# Altium schematic sheet STM32F750N8H6.SchDoc
size C
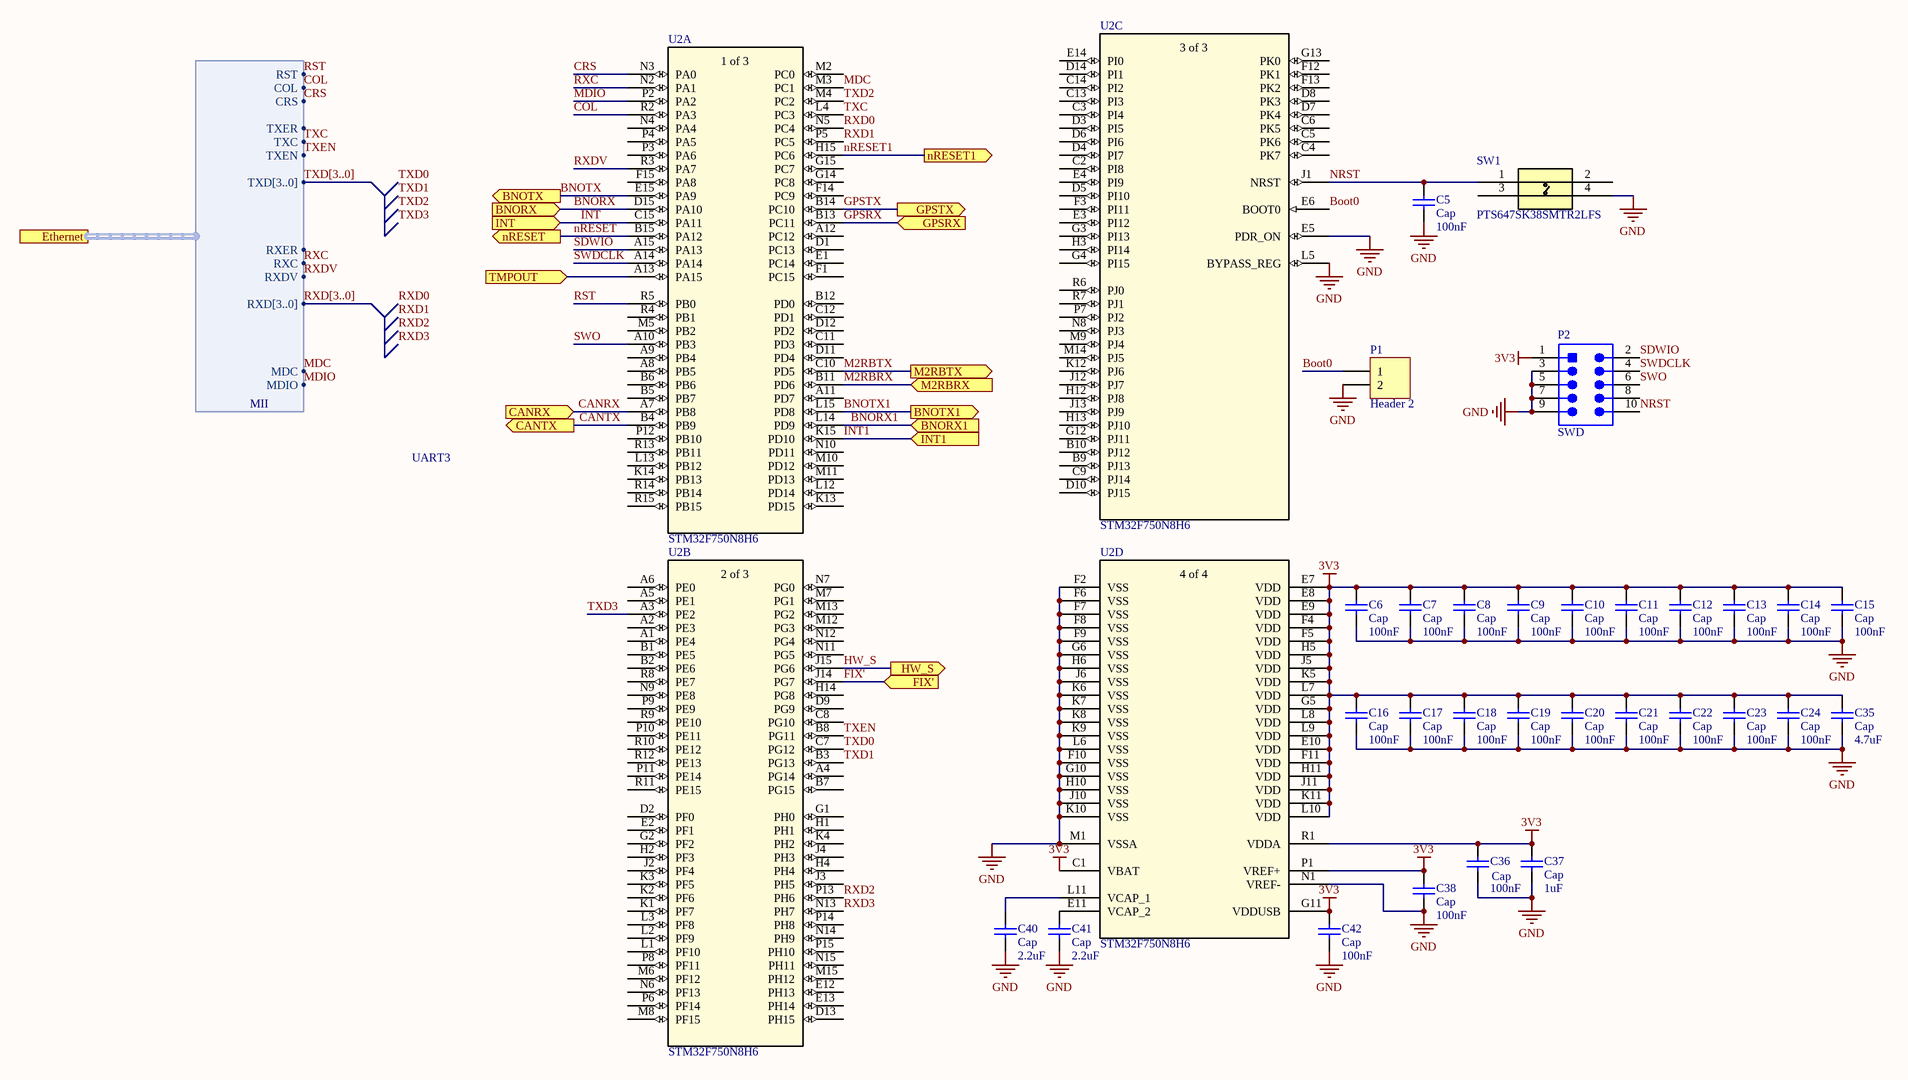
[diagram p0: STM32F750N8H6.SchDoc]

## Parts
C5  Cap  value 100nF  [1608[0603]]
C6  Cap  value 100nF  [0402-A]
C7  Cap  value 100nF  [0402-A]
C8  Cap  value 100nF  [0402-A]
C9  Cap  value 100nF  [0402-A]
C10  Cap  value 100nF  [0402-A]
C11  Cap  value 100nF  [0402-A]
C12  Cap  value 100nF  [0402-A]
C13  Cap  value 100nF  [0402-A]
C14  Cap  value 100nF  [0402-A]
C15  Cap  value 100nF  [0402-A]
C16  Cap  value 100nF  [0402-A]
C17  Cap  value 100nF  [0402-A]
C18  Cap  value 100nF  [0402-A]
C19  Cap  value 100nF  [0402-A]
C20  Cap  value 100nF  [0402-A]
C21  Cap  value 100nF  [0402-A]
C22  Cap  value 100nF  [0402-A]
C23  Cap  value 100nF  [0402-A]
C24  Cap  value 100nF  [0402-A]
C35  Cap  value 4.7uF  [1608[0603]]
C36  Cap  value 100nF  [0402-A]
C37  Cap  value 1uF  [0402-A]
C38  Cap  value 100nF  [0402-A]
C40  Cap  value 2.2uF  [0402-A]
C41  Cap  value 2.2uF  [0402-A]
C42  Cap  value 100nF  [0402-A]
P1  Header 2  [HDR1X2]
P2  SWD  [SMTC-FTSH-105-01-L-DV-K_V]
SW1  PTS647SK38SMTR2LFS  [PTS647SK38SMTR2LFS_CNK]
U2  STM32F750N8H6  [TFBGA216_13X13_STM]  (parts A,B,C,D of 4)

## Ports
BNORX1 (in), BNORX (in), BNOTX1 (out), BNOTX (out), CANRX (in), CANTX (out), Ethernet (harness MII), FIX' (in), GPSRX (in), GPSTX (out), HW_S (out), INT1 (in), INT (in), M2RBRX (in), M2RBTX (out), nRESET1 (out), nRESET (out), TMPOUT (in)

## Harnesses
MII: MDIO, MDC, RXD[3..0], TXD[3..0], RXDV, RXC, RXER, TXEN, TXC, TXER, CRS, COL, RST

## Nets
3V3: C6.2 C7.2 C8.2 C9.2 C10.2 C11.2 C12.2 C13.2 C14.2 C15.2 C16.2 C17.2 C18.2 C19.2 C20.2 C21.2 C22.2 C23.2 C24.2 C35.2 C36.2 C37.2 C38.2 C42.2 P2.1 U2.C1(VBAT) U2.E7(VDD) U2.E8(VDD) U2.E9(VDD) U2.E10(VDD) U2.F4(VDD) U2.F5(VDD) U2.F11(VDD) U2.G5(VDD) U2.G11(VDDUSB) U2.H5(VDD) U2.H11(VDD) U2.J5(VDD) U2.J11(VDD) U2.K5(VDD) U2.K11(VDD) U2.L7(VDD) U2.L8(VDD) U2.L9(VDD) U2.L10(VDD) U2.P1(VREF+) U2.R1(VDDA)
GND: C5.1 C6.1 C7.1 C8.1 C9.1 C10.1 C11.1 C12.1 C13.1 C14.1 C15.1 C16.1 C17.1 C18.1 C19.1 C20.1 C21.1 C22.1 C23.1 C24.1 C35.1 C36.1 C37.1 C38.1 C40.1 C41.1 C42.1 P1.2 P2.3 P2.5 P2.7 P2.9 SW1.4 U2.E5(PDR_ON) U2.F2(VSS) U2.F6(VSS) U2.F7(VSS) U2.F8(VSS) U2.F9(VSS) U2.F10(VSS) U2.G6(VSS) U2.G10(VSS) U2.H6(VSS) U2.H10(VSS) U2.J6(VSS) U2.J10(VSS) U2.K6(VSS) U2.K7(VSS) U2.K8(VSS) U2.K9(VSS) U2.K10(VSS) U2.L5(BYPASS_REG) U2.L6(VSS) U2.M1(VSSA) U2.N1(VREF-)
BNORX: U2.D15(PA10) ; port BNORX
BNORX1: U2.L14(PD9) ; port BNORX1
BNOTX: U2.E15(PA9) ; port BNOTX
BNOTX1: U2.L15(PD8) ; port BNOTX1
Boot0: P1.1 U2.E6(BOOT0)
CANRX: U2.A7(PB8) ; port CANRX
CANTX: U2.B4(PB9) ; port CANTX
COL: U2.R2(PA3) ; port Ethernet.COL
CRS: U2.N3(PA0) ; port Ethernet.CRS
FIX': U2.J14(PG7) ; port FIX'
GPSRX: U2.B13(PC11) ; port GPSRX
GPSTX: U2.B14(PC10) ; port GPSTX
HW_S: U2.J15(PG6) ; port HW_S
INT: U2.C15(PA11) ; port INT
INT1: U2.K15(PD10) ; port INT1
M2RBRX: U2.B11(PD6) ; port M2RBRX
M2RBTX: U2.C10(PD5) ; port M2RBTX
MDC: U2.M3(PC1) ; port Ethernet.MDC
MDIO: U2.P2(PA2) ; port Ethernet.MDIO
nRESET: U2.B15(PA12) ; port nRESET
nRESET1: U2.H15(PC6) ; port nRESET1
NRST: C5.2 P2.10 SW1.1 U2.J1(NRST)
RST: U2.R5(PB0) ; port Ethernet.RST
RXC: U2.N2(PA1) ; port Ethernet.RXC
RXD0: U2.N5(PC4)
RXD1: U2.P5(PC5)
RXD2: U2.P13(PH6)
RXD3: U2.N13(PH7)
RXDV: U2.R3(PA7) ; port Ethernet.RXDV
SDWIO: P2.2 U2.A15(PA13)
SWDCLK: P2.4 U2.A14(PA14)
SWO: P2.6 U2.A10(PB3)
TMPOUT: U2.A13(PA15) ; port TMPOUT
TXC: U2.L4(PC3) ; port Ethernet.TXC
TXD0: U2.C7(PG12)
TXD1: U2.B3(PG13)
TXD2: U2.M4(PC2)
TXD3: U2.A3(PE2)
TXEN: U2.B8(PG11) ; port Ethernet.TXEN
NetC40_2: C40.2 U2.L11(VCAP_1)
NetC41_2: C41.2 U2.E11(VCAP_2)

Not connected (* = marked no-connect by the designer): P2 8; SW1 2 3; U2 A1(PE4) A2(PE3) A4(PG14) A5(PE1) A6(PE0) A8(PB5) A9(PB4) A11(PD7) A12(PC12) B1(PE5) B2(PE6) B5(PB7) B6(PB6) B7(PG15) B9(PJ13) B10(PJ12) B12(PD0) C2(PI8) C3(PI4) C4(PK7) C5(PK6) C6(PK5) C8(PG10) C9(PJ14) C11(PD3) C12(PD1) C13(PI3) C14(PI2) D1(PC13) D2(PF0) D3(PI5) D4(PI7) D5(PI10) D6(PI6) D7(PK4) D8(PK3) D9(PG9) D10(PJ15) D11(PD4) D12(PD2) D13(PH15) D14(PI1) E1(PC14) E2(PF1) E3(PI12) E4(PI9) E12(PH13) E13(PH14) E14(PI0) F1(PC15) F3(PI11) F12(PK1) F13(PK2) F14(PC9) F15(PA8) G1(PH0) G2(PF2) G3(PI13) G4(PI15) G12(PJ11) G13(PK0) G14(PC8) G15(PC7) H1(PH1) H2(PF3) H3(PI14) H4(PH4) H12(PJ8) H13(PJ10) H14(PG8) J2(PF4) J3(PH5) J4(PH3) J12(PJ7) J13(PJ9) K1(PF7) K2(PF6) K3(PF5) K4(PH2) K12(PJ6) K13(PD15) K14(PB13) L1(PF10) L2(PF9) L3(PF8) L12(PD14) L13(PB12) M2(PC0) M5(PB2) M6(PF12) M7(PG1) M8(PF15) M9(PJ4) M10(PD12) M11(PD13) M12(PG3) M13(PG2) M14(PJ5) M15(PH12) N4(PA4) N6(PF13) N7(PG0) N8(PJ3) N9(PE8) N10(PD11) N11(PG5) N12(PG4) N14(PH9) N15(PH11) P3(PA6) P4(PA5) P6(PF14) P7(PJ2) P8(PF11) P9(PE9) P10(PE11) P11(PE14) P12(PB10) P14(PH8) P15(PH10) R4(PB1) R6(PJ0) R7(PJ1) R8(PE7) R9(PE10) R10(PE12) R11(PE15) R12(PE13) R13(PB11) R14(PB14) R15(PB15)

## Buses and harness runs
bus RXD[3..0]
bus TXD[3..0]

## Notes on the sheet
- UART3
- Labels drawn without touching a wire or pin: RXD0, RXD1, RXD2, RXD3, TXD0, TXD1, TXD2, TXD3
- (in symbol STM32F750N8H6, part A) 1 of 3
- (in symbol STM32F750N8H6, part B) 2 of 3
- (in symbol STM32F750N8H6, part C) 3 of 3
- (in symbol STM32F750N8H6, part D) 4 of 4

## Library data of the parts
C5-C24 C35-C38 C40-C42 = Cap: Capacitor; Published: 8-Jun-2000; LatestRevisionDate: 17-Jul-2002; LatestRevisionNote: Re-released for DXP Platform.; PackageReference: RAD-0.3; Publisher: Altium Limited; PackageDescription: Radial Cap, Thru-Hole; 2 Leads; 0.3 in Pin Spacing
P1 = Header 2: Header, 2-Pin; LatestRevisionDate: 17-Jul-2002; LatestRevisionNote: Re-released for DXP Platform.; Publisher: Altium Limited
P2 = CMP-2000-05353-1: Male Header, Pitch 1.27 mm, 2 x 5 Position, Height 6.25 mm; Manufacturer: Samtec; Pitch: 0.050"(1.27mm); Other Names: Q3937619; Number of Positions: 10; Mating Products: SFMC-105-L2-S-D-TR-ND / -CONN.05"SURFACE10POSSMT / FLE-105-01-G-DV-TR-ND / -CONNSKT1.27MM10POSDUALSMD / FLE-105-01-G-DV-A-P-ND / -CONNSKT1.27MM10POSDUALSMD / FLE-105-01-G-DV-A-ND / -CONNSKT1.27MM10POSDUALSMD / CLP-105-02-G-D-P-TR-ND / -CONNRCPT10POSDUAL.05"SMD / SAM1155-05-ND / -CONNRCPT10POSDUAL.05"SMD / SAM1154-05-ND / -CONNRCPT10POSDUAL.05"SMD / SAM1153-05-ND / -CONNRCPT10POSDUAL.05"SMD / SAM1226-05-ND / -CONNRCPT.05"10POSDUALSMD; Number of Positions Loaded: All; Connector Type: Header,Unshrouded; Product Training Modules: Board-to-BoardConnectors; Datasheet Version: Rev. ET, 10/1995; Number of Rows: 2; Standard Package: 1; Package Description: Male Header, Pitch 1.27 mm, 2 x 5 Position, Height 5.97 mm, Tail Length 4.32 mm; Contact Finish Thickness: 10µin(0.25µm); Series: FTSH; Termination: Solder; Contact Type: MalePin; Color: Black; Package Reference: FTSH-105-01-L-DV-K; Family: RectangularConnectors-Headers,MalePins; Package URL: http://suddendocs.samtec.com/prints/ftsh-1xx-xx-xxx-dv-xxx-footprint.pdf; Packaging: Tube; Mounting Type: SurfaceMount; Category: Connectors,Interconnects; Datasheet URL: http://suddendocs.samtec.com/prints/ftsh-1xx-xx-xxx-dv-xxx-mkt.pdf; Row Spacing: 0.050"(1.27mm); Manufacturer URL: http://www.samtec.com/; Contact Mating Length: 0.120"(3.05mm); Contact Finish: Gold
SW1 = PTS647SK38SMTR2LFS: No Description Available; Vendor: C&K; Built_By: EMA_Cory; SourceLibrary: C&K_2020-05-06; Datasheet: https://www.ckswitches.com/media/2567/pts647.pdf; Manufacturer_Part_Number: PTS647SK38SMTR2LFS; Copyright: Copyright (C) 2018 Accelerated Designs. All rights reserved; RefDes: RefDes; Type: DEV
U2 = STM32F750N8H6: No Description Available; Built_By: EMA_Jessica; Vendor: STMicroelectronics; SourceLibrary: Add_to_database_2020-10-19; Copyright: Copyright (C) 2018 Accelerated Designs. All rights reserved; Manufacturer_Part_Number: STM32F750N8H6; RefDes: RefDes; Type: DEV